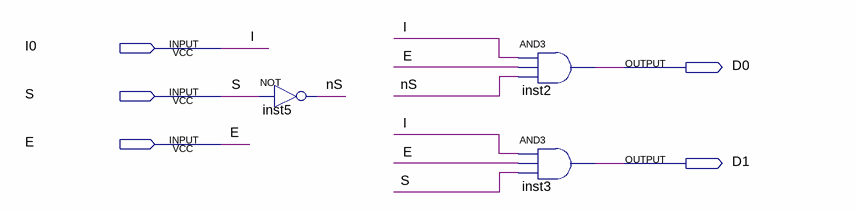
[diagram p0: schematic sheet]
// Quartus schematic DMPX2.bdf as structural Verilog: 3 symbols, 5 pins
module DMPX2 (
  input  I0,
  input  S,
  input  E,
  output D0,
  output D1
);

  wire nS;

  not inst5 (nS, S);
  and inst2 (D0, I0, E, nS);
  and inst3 (D1, I0, E, S);

  // Other names for the same wires on the sheet: I = I0
endmodule
